# EAGLE design ShieldEsquematico (EAGLE 9.1.3)
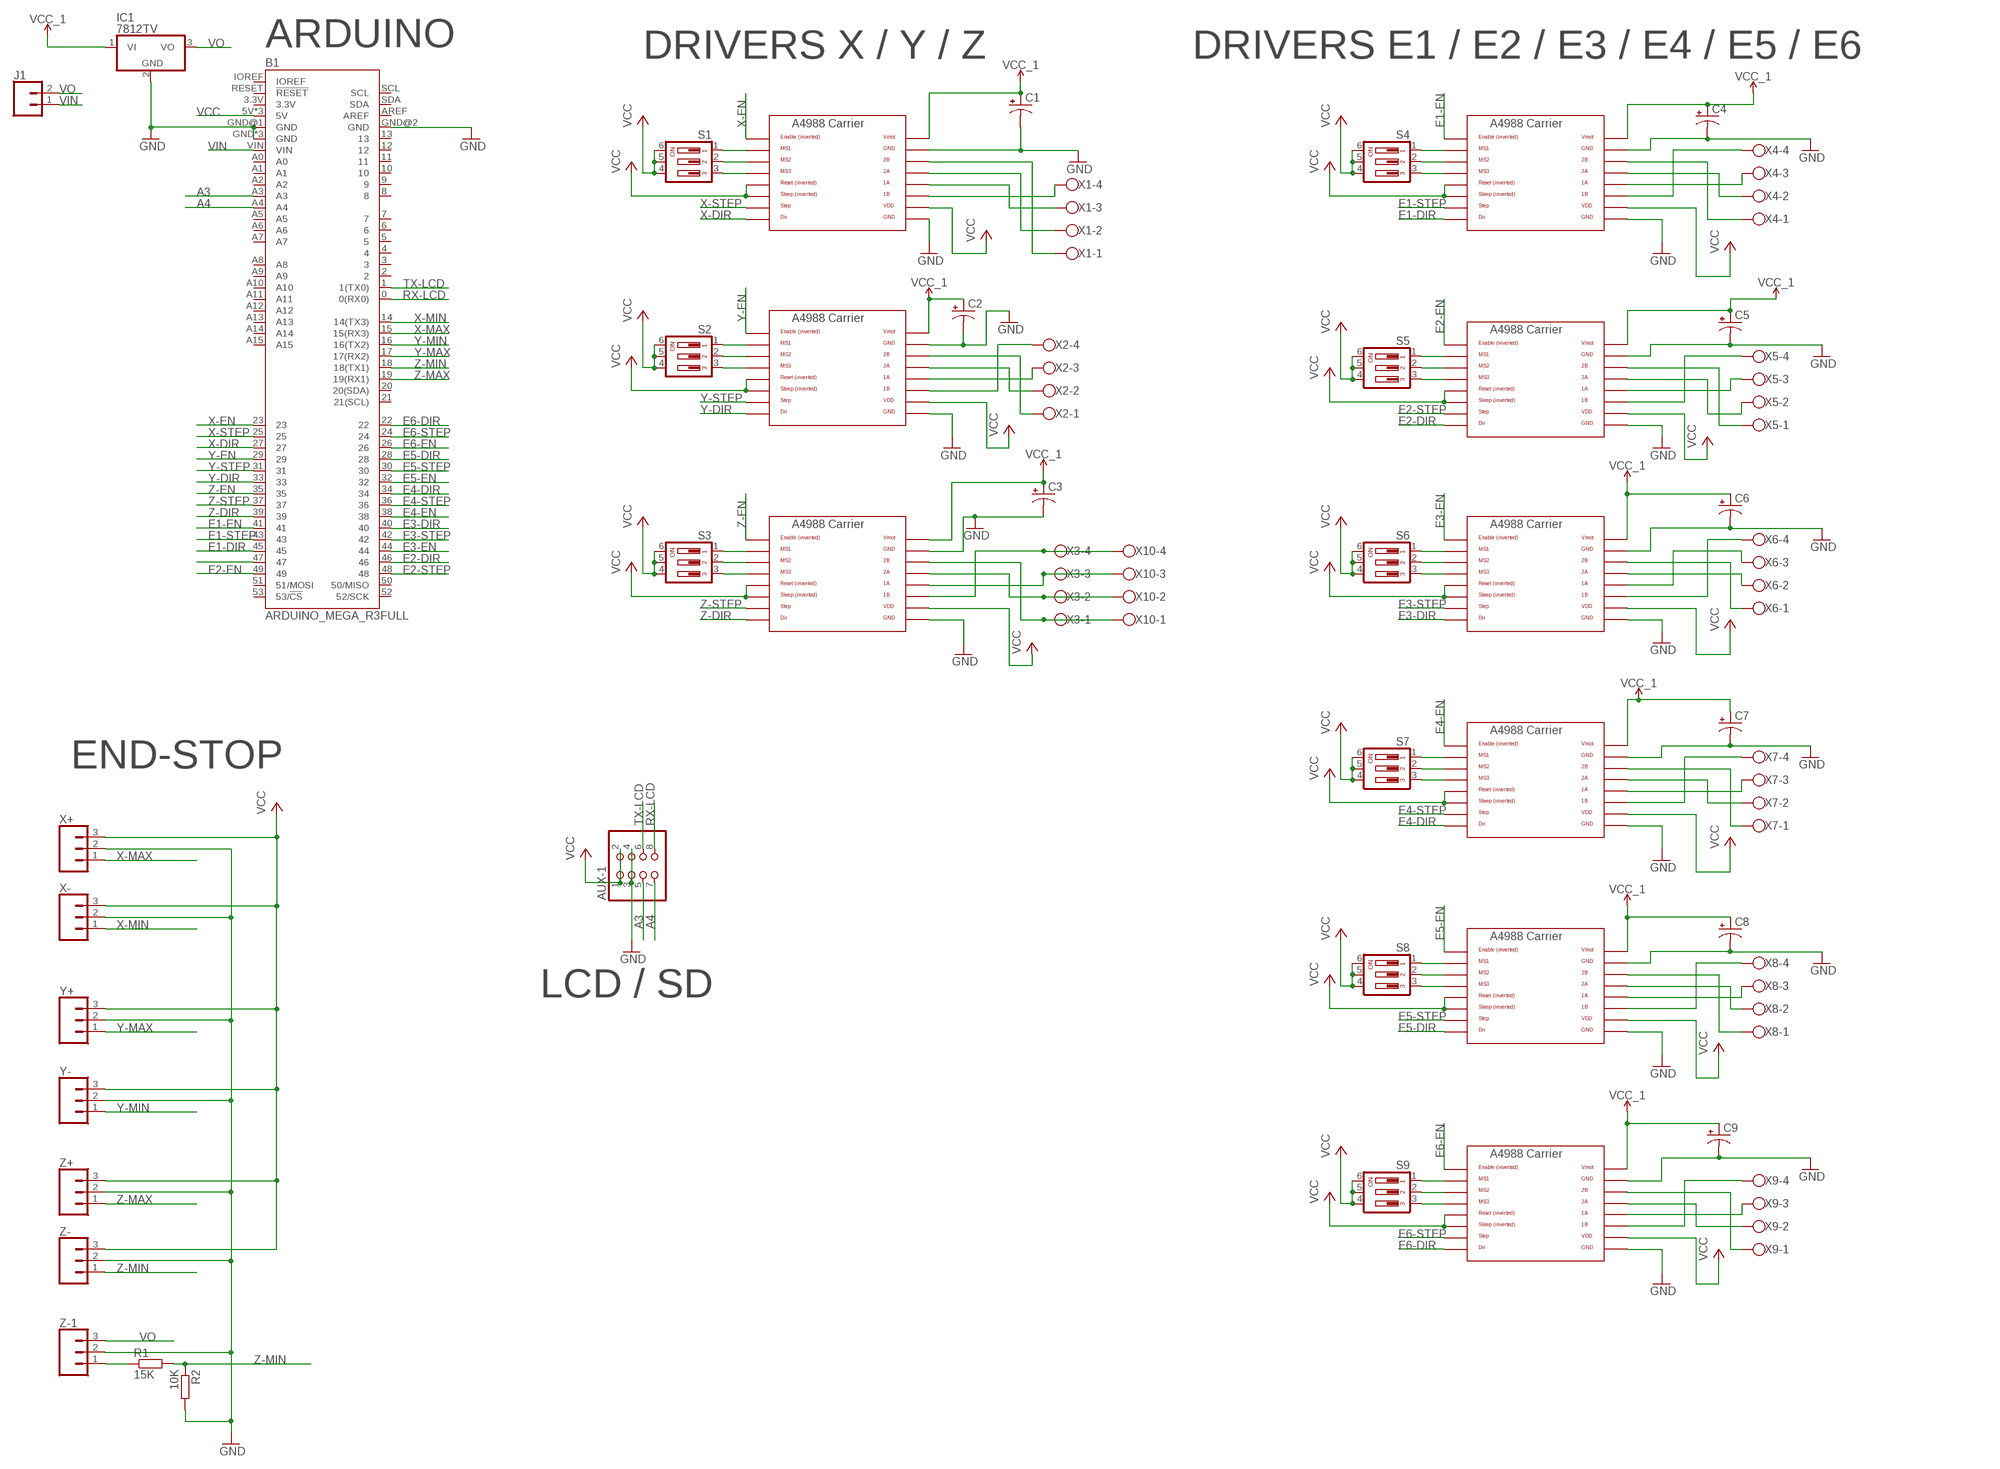
[diagram p0: schematic, sheet 1]

## Parts
AUX-1  PINHD-2X4  [2X04]
B1  ARDUINO_MEGA_R3FULL  [ARDUINO_MEGA_NO_SILK]
C1  CPOL-USE5-8.5  [E5-8,5]
C2  CPOL-USE5-8.5  [E5-8,5]
C3  CPOL-USE5-8.5  [E5-8,5]
C4  CPOL-USE5-8.5  [E5-8,5]
C5  CPOL-USE5-8.5  [E5-8,5]
C6  CPOL-USE5-8.5  [E5-8,5]
C7  CPOL-USE5-8.5  [E5-8,5]
C8  CPOL-USE5-8.5  [E5-8,5]
C9  CPOL-USE5-8.5  [E5-8,5]
IC1  7812TV  [TO220V]
J1  CONN_02  [1X02]
R1  15K  R-EU_0207/10  [0207/10]
R2  10K  R-EU_0207/10  [0207/10]
S1  DIP03YL  [DIP03YL]
S2  DIP03YL  [DIP03YL]
S3  DIP03YL  [DIP03YL]
S4  DIP03YL  [DIP03YL]
S5  DIP03YL  [DIP03YL]
S6  DIP03YL  [DIP03YL]
S7  DIP03YL  [DIP03YL]
S8  DIP03YL  [DIP03YL]
S9  DIP03YL  [DIP03YL]
U$1  A4988BREAKOUT  [A4988BREAKOUT]
U$2  A4988BREAKOUT  [A4988BREAKOUT]
U$3  A4988BREAKOUT  [A4988BREAKOUT]
U$4  A4988BREAKOUT  [A4988BREAKOUT]
U$5  A4988BREAKOUT  [A4988BREAKOUT]
U$6  A4988BREAKOUT  [A4988BREAKOUT]
U$7  A4988BREAKOUT  [A4988BREAKOUT]
U$8  A4988BREAKOUT  [A4988BREAKOUT]
U$9  A4988BREAKOUT  [A4988BREAKOUT]
X1  W237-4  [W237-4]
X2  W237-4  [W237-4]
X3  W237-4  [W237-4]
X4  W237-4  [W237-4]
X5  W237-4  [W237-4]
X6  W237-4  [W237-4]
X7  W237-4  [W237-4]
X8  W237-4  [W237-4]
X9  W237-4  [W237-4]
X10  W237-4  [W237-4]
X+  CONN_03SCREW_LOCK  [SCREWTERMINAL-3.5MM-3_LOCK.007S]
X-  CONN_03SCREW_LOCK  [SCREWTERMINAL-3.5MM-3_LOCK.007S]
Y+  CONN_03SCREW_LOCK  [SCREWTERMINAL-3.5MM-3_LOCK.007S]
Y-  CONN_03SCREW_LOCK  [SCREWTERMINAL-3.5MM-3_LOCK.007S]
Z+  CONN_03SCREW_LOCK  [SCREWTERMINAL-3.5MM-3_LOCK.007S]
Z-  CONN_03SCREW_LOCK  [SCREWTERMINAL-3.5MM-3_LOCK.007S]
Z-1  CONN_03SCREW_LOCK  [SCREWTERMINAL-3.5MM-3_LOCK.007S]

## Nets
A3: AUX-1.5 B1.A3
A4: AUX-1.7 B1.A4
E1-DIR: B1.45 U$4.DIR
E1-EN: B1.41 U$4.EN
E1-STEP: B1.43 U$4.STEP
E2-DIR: B1.46 U$5.DIR
E2-EN: B1.49 U$5.EN
E2-STEP: B1.48 U$5.STEP
E3-DIR: B1.40 U$6.DIR
E3-EN: B1.44 U$6.EN
E3-STEP: B1.42 U$6.STEP
E4-DIR: B1.34 U$7.DIR
E4-EN: B1.38 U$7.EN
E4-STEP: B1.36 U$7.STEP
E5-DIR: B1.28 U$8.DIR
E5-EN: B1.32 U$8.EN
E5-STEP: B1.30 U$8.STEP
E6-DIR: B1.22 U$9.DIR
E6-EN: B1.26 U$9.EN
E6-STEP: B1.24 U$9.STEP
GND: AUX-1.3 AUX-1.4 B1.GND B1.GND@1(GND) B1.GND@2(GND) B1.GND@3(GND) B1.GND@4(GND) C1.- C2.- C3.- C4.- C5.- C6.- C7.- C8.- C9.- IC1.2(GND) R2.2 U$1.GND U$1.GND@0(GND) U$2.GND U$2.GND@0(GND) U$3.GND U$3.GND@0(GND) U$4.GND U$4.GND@0(GND) U$5.GND U$5.GND@0(GND) U$6.GND U$6.GND@0(GND) U$7.GND U$7.GND@0(GND) U$8.GND U$8.GND@0(GND) U$9.GND U$9.GND@0(GND) X+.2 X-.2 Y+.2 Y-.2 Z+.2 Z-1.2 Z-.2
N$1: S1.1 U$1.MS1
N$2: S1.2 U$1.MS2
N$3: S1.3 U$1.MS3
N$4: U$1.1B X1.4
N$5: U$1.1A X1.3
N$6: U$1.2A X1.2
N$7: U$1.2B X1.1
N$8: S2.1 U$2.MS1
N$10: S2.2 U$2.MS2
N$11: S2.3 U$2.MS3
N$12: U$2.1B X2.4
N$13: U$3.2B X3.1 X10.1
N$14: U$2.2A X2.2
N$15: U$2.2B X2.1
N$16: S3.1 U$3.MS1
N$17: S3.2 U$3.MS2
N$18: S3.3 U$3.MS3
N$19: U$3.2A X3.2 X10.2
N$20: U$3.1A X3.3 X10.3
N$21: U$3.1B X3.4 X10.4
N$22: U$4.2B X4.1
N$23: S4.1 U$4.MS1
N$24: S4.2 U$4.MS2
N$25: S4.3 U$4.MS3
N$26: U$4.2A X4.2
N$27: U$4.1A X4.3
N$28: U$4.1B X4.4
N$29: U$6.1A X6.3
N$30: S5.1 U$5.MS1
N$31: S5.2 U$5.MS2
N$32: S5.3 U$5.MS3
N$33: U$5.2B X5.1
N$34: U$5.2A X5.2
N$35: U$5.1A X5.3
N$36: U$5.1B X5.4
N$37: S6.1 U$6.MS1
N$38: S6.2 U$6.MS2
N$39: S6.3 U$6.MS3
N$40: U$6.1B X6.4
N$41: U$7.2A X7.2
N$42: U$6.2A X6.2
N$43: U$6.2B X6.1
N$44: S7.1 U$7.MS1
N$45: S7.2 U$7.MS2
N$46: S7.3 U$7.MS3
N$47: U$7.1A X7.3
N$48: U$7.1B X7.4
N$49: U$9.2B X9.1
N$50: U$7.2B X7.1
N$51: S8.1 U$8.MS1
N$52: S8.2 U$8.MS2
N$53: S8.3 U$8.MS3
N$54: U$8.2B X8.1
N$55: U$8.2A X8.2
N$56: U$8.1A X8.3
N$57: U$8.1B X8.4
N$58: S9.1 U$9.MS1
N$59: S9.2 U$9.MS2
N$60: S9.3 U$9.MS3
N$61: U$9.2A X9.2
N$62: U$9.1A X9.3
N$63: U$9.1B X9.4
N$64: R1.1 Z-1.1
N$65: U$2.1A X2.3
N$76: B1.47
RX-LCD: AUX-1.8 B1.0(0(RX0))
TX-LCD: AUX-1.6 B1.1(1(TX0))
VCC: AUX-1.1 AUX-1.2 B1.5V B1.5V@1(5V) B1.5V@2(5V) S1.4 S1.5 S1.6 S2.4 S2.5 S2.6 S3.4 S3.5 S3.6 S4.4 S4.5 S4.6 S5.4 S5.5 S5.6 S6.4 S6.5 S6.6 S7.4 S7.5 S7.6 S8.4 S8.5 S8.6 S9.4 S9.5 S9.6 U$1.RST U$1.SLP(SLEEP) U$1.VDD U$2.RST U$2.SLP(SLEEP) U$2.VDD U$3.RST U$3.SLP(SLEEP) U$3.VDD U$4.RST U$4.SLP(SLEEP) U$4.VDD U$5.RST U$5.SLP(SLEEP) U$5.VDD U$6.RST U$6.SLP(SLEEP) U$6.VDD U$7.RST U$7.SLP(SLEEP) U$7.VDD U$8.RST U$8.SLP(SLEEP) U$8.VDD U$9.RST U$9.SLP(SLEEP) U$9.VDD X+.3 X-.3 Y+.3 Y-.3 Z+.3 Z-.3
VCC_1: C1.+ C2.+ C3.+ C4.+ C5.+ C6.+ C7.+ C8.+ C9.+ IC1.1(VI) U$1.VMOT U$2.VMOT U$3.VMOT U$4.VMOT U$5.VMOT U$6.VMOT U$7.VMOT U$8.VMOT U$9.VMOT
VIN: B1.VIN J1.1
VO: IC1.3(VO) J1.2 Z-1.3
X-DIR: B1.27 U$1.DIR
X-EN: B1.23 U$1.EN
X-MAX: B1.15(15(RX3)) X+.1
X-MIN: B1.14(14(TX3)) X-.1
X-STEP: B1.25 U$1.STEP
Y-DIR: B1.33 U$2.DIR
Y-EN: B1.29 U$2.EN
Y-MAX: B1.17(17(RX2)) Y+.1
Y-MIN: B1.16(16(TX2)) Y-.1
Y-STEP: B1.31 U$2.STEP
Z-DIR: B1.39 U$3.DIR
Z-EN: B1.35 U$3.EN
Z-MAX: B1.19(19(RX1)) Z+.1
Z-MIN: B1.18(18(TX1)) R1.2 R2.1 Z-.1
Z-STEP: B1.37 U$3.STEP
Unconnected: B1.2 B1.3 B1.3.3V B1.4 B1.5 B1.6 B1.7 B1.8 B1.9 B1.10 B1.11 B1.12 B1.13 B1.20(20(SDA)) B1.21(21(SCL)) B1.50(50/MISO) B1.51(51/MOSI) B1.52(52/SCK) B1.53(53/!CS) B1.A0 B1.A1 B1.A2 B1.A5 B1.A6 B1.A7 B1.A8 B1.A9 B1.A10 B1.A11 B1.A12 B1.A13 B1.A14 B1.A15 B1.AREF B1.IOREF B1.RESET(!RESET) B1.SCL B1.SDA

## Notes on the sheet
- ARDUINO | DRIVERS X / Y / Z | DRIVERS E1 / E2 / E3 / E4 / E5 / E6
- END-STOP
- LCD / SD

## Library data of the parts
AUX-1 = pinhead:PINHD-2X4: PIN HEADER
B1 = SparkFun-Boards:ARDUINO_MEGA_R3: Arduino Mega R3 ATmega2560 R3 compatible footprint. SparkFun Products: Arduino Mega 2560 R3 <https://www.sparkfun.com/products/11061>
C1-C9 = resistor:CPOL-US: POLARIZED CAPACITOR, American symbol
IC1 = linear:78*: Positive VOLTAGE REGULATOR Source: http://cache.national.com/ds/LM/LM78L05.pdf http://www.fairchildsemi.com/ds/LM/LM7805.pdf
J1 = SparkFun-Connectors:CONN_02: Multi connection point. Often used as Generic Header-pin footprint for 0.1 inch spaced/style header connections On any of the 0.1 inch spaced packages, you can populate with these: Break Away Headers - Straight <https://www.sparkfun.com/products/116> (PRT-00116) Break Away Male Headers - Right Angle <https://www.sparkfun.com/products/553> (PRT-00553) Female Headers <https://www.sparkfun.com/products/115> (PRT-00115) Break Away Headers - Machine Pin <https://www.sparkfun.com/products/117> (PRT-00117) Break Away Female Headers - Swiss Machine Pin <https://www.sparkfun.com/products/743> (PRT-00743) For SCREWTERMINALS and SPRING TERMINALS visit here: Screw Terimnals on SparkFun.com <https://www.sparkfun.com/search/results?term=Screw+Terminals> (5mm/3.5mm/2.54mm spacing) This device is also useful as a general connection point to wire up your design to another part of your project. Our various solder wires solder well into these plated through hole pads. Hook-Up Wire - Assortment (Stranded, 22 AWG) <https://www.sparkfun.com/products/11375> (PRT-11375) Hook-Up Wire - Assortment (Solid Core, 22 AWG) <https://www.sparkfun.com/products/11367> (PRT-11367) View the entire wire category on our website here <https://www.sparkfun.com/categories/141> Special notes: Molex polarized connector foot print use with: PRT-08233 with associated crimp pins and housings. 2.54_SCREWTERM for use with PRT-10571. 3.5mm Screw Terminal footprints for PRT-08084 5mm Screw Terminal footprints for use with PRT-08432
R1 R2 = rcl:R-EU_: RESISTOR, European symbol; SPICEPREFIX: R
S1-S9 = switch-dil:DIP03YL: DIL/CODE SWITCH; OC_FARNELL: unknown; OC_NEWARK: unknown
U$1-U$9 = RepRapjr:A4988BREAKOUT
X1-X10 = con-wago-500:W237-4: WAGO SCREW CLAMP; OC_FARNELL: unknown; OC_NEWARK: unknown
X+ X- Y+ Y- Z+ Z- Z-1 = SparkFun-Connectors:CONN_03: Multi connection point. Often used as Generic Header-pin footprint for 0.1 inch spaced/style header connections On any of the 0.1 inch spaced packages, you can populate with these: Break Away Headers - Straight <https://www.sparkfun.com/products/116> (PRT-00116) Break Away Male Headers - Right Angle <https://www.sparkfun.com/products/553> (PRT-00553) Female Headers <https://www.sparkfun.com/products/115> (PRT-00115) Break Away Headers - Machine Pin <https://www.sparkfun.com/products/117> (PRT-00117) Break Away Female Headers - Swiss Machine Pin <https://www.sparkfun.com/products/743> (PRT-00743) Stackable Header - 3 Pin (Female, 0.1") <https://www.sparkfun.com/products/13875> (PRT-13875) For SCREWTERMINALS and SPRING TERMINALS visit here: Screw Terimnals on SparkFun.com <https://www.sparkfun.com/search/results?term=Screw+Terminals> (5mm/3.5mm/2.54mm spacing) This device is also useful as a general connection point to wire up your design to another part of your project. Our various solder wires solder well into these plated through hole pads. Hook-Up Wire - Assortment (Stranded, 22 AWG) <https://www.sparkfun.com/products/11375> (PRT-11375) Hook-Up Wire - Assortment (Solid Core, 22 AWG) <https://www.sparkfun.com/products/11367> (PRT-11367) View the entire wire category on our website here <https://www.sparkfun.com/categories/141> Special notes: Molex polarized connector foot print use with SKU : PRT-08232 with associated crimp pins and housings.; PROD_ID: CONN-08288; SF_ID: PRT-08235

## Board
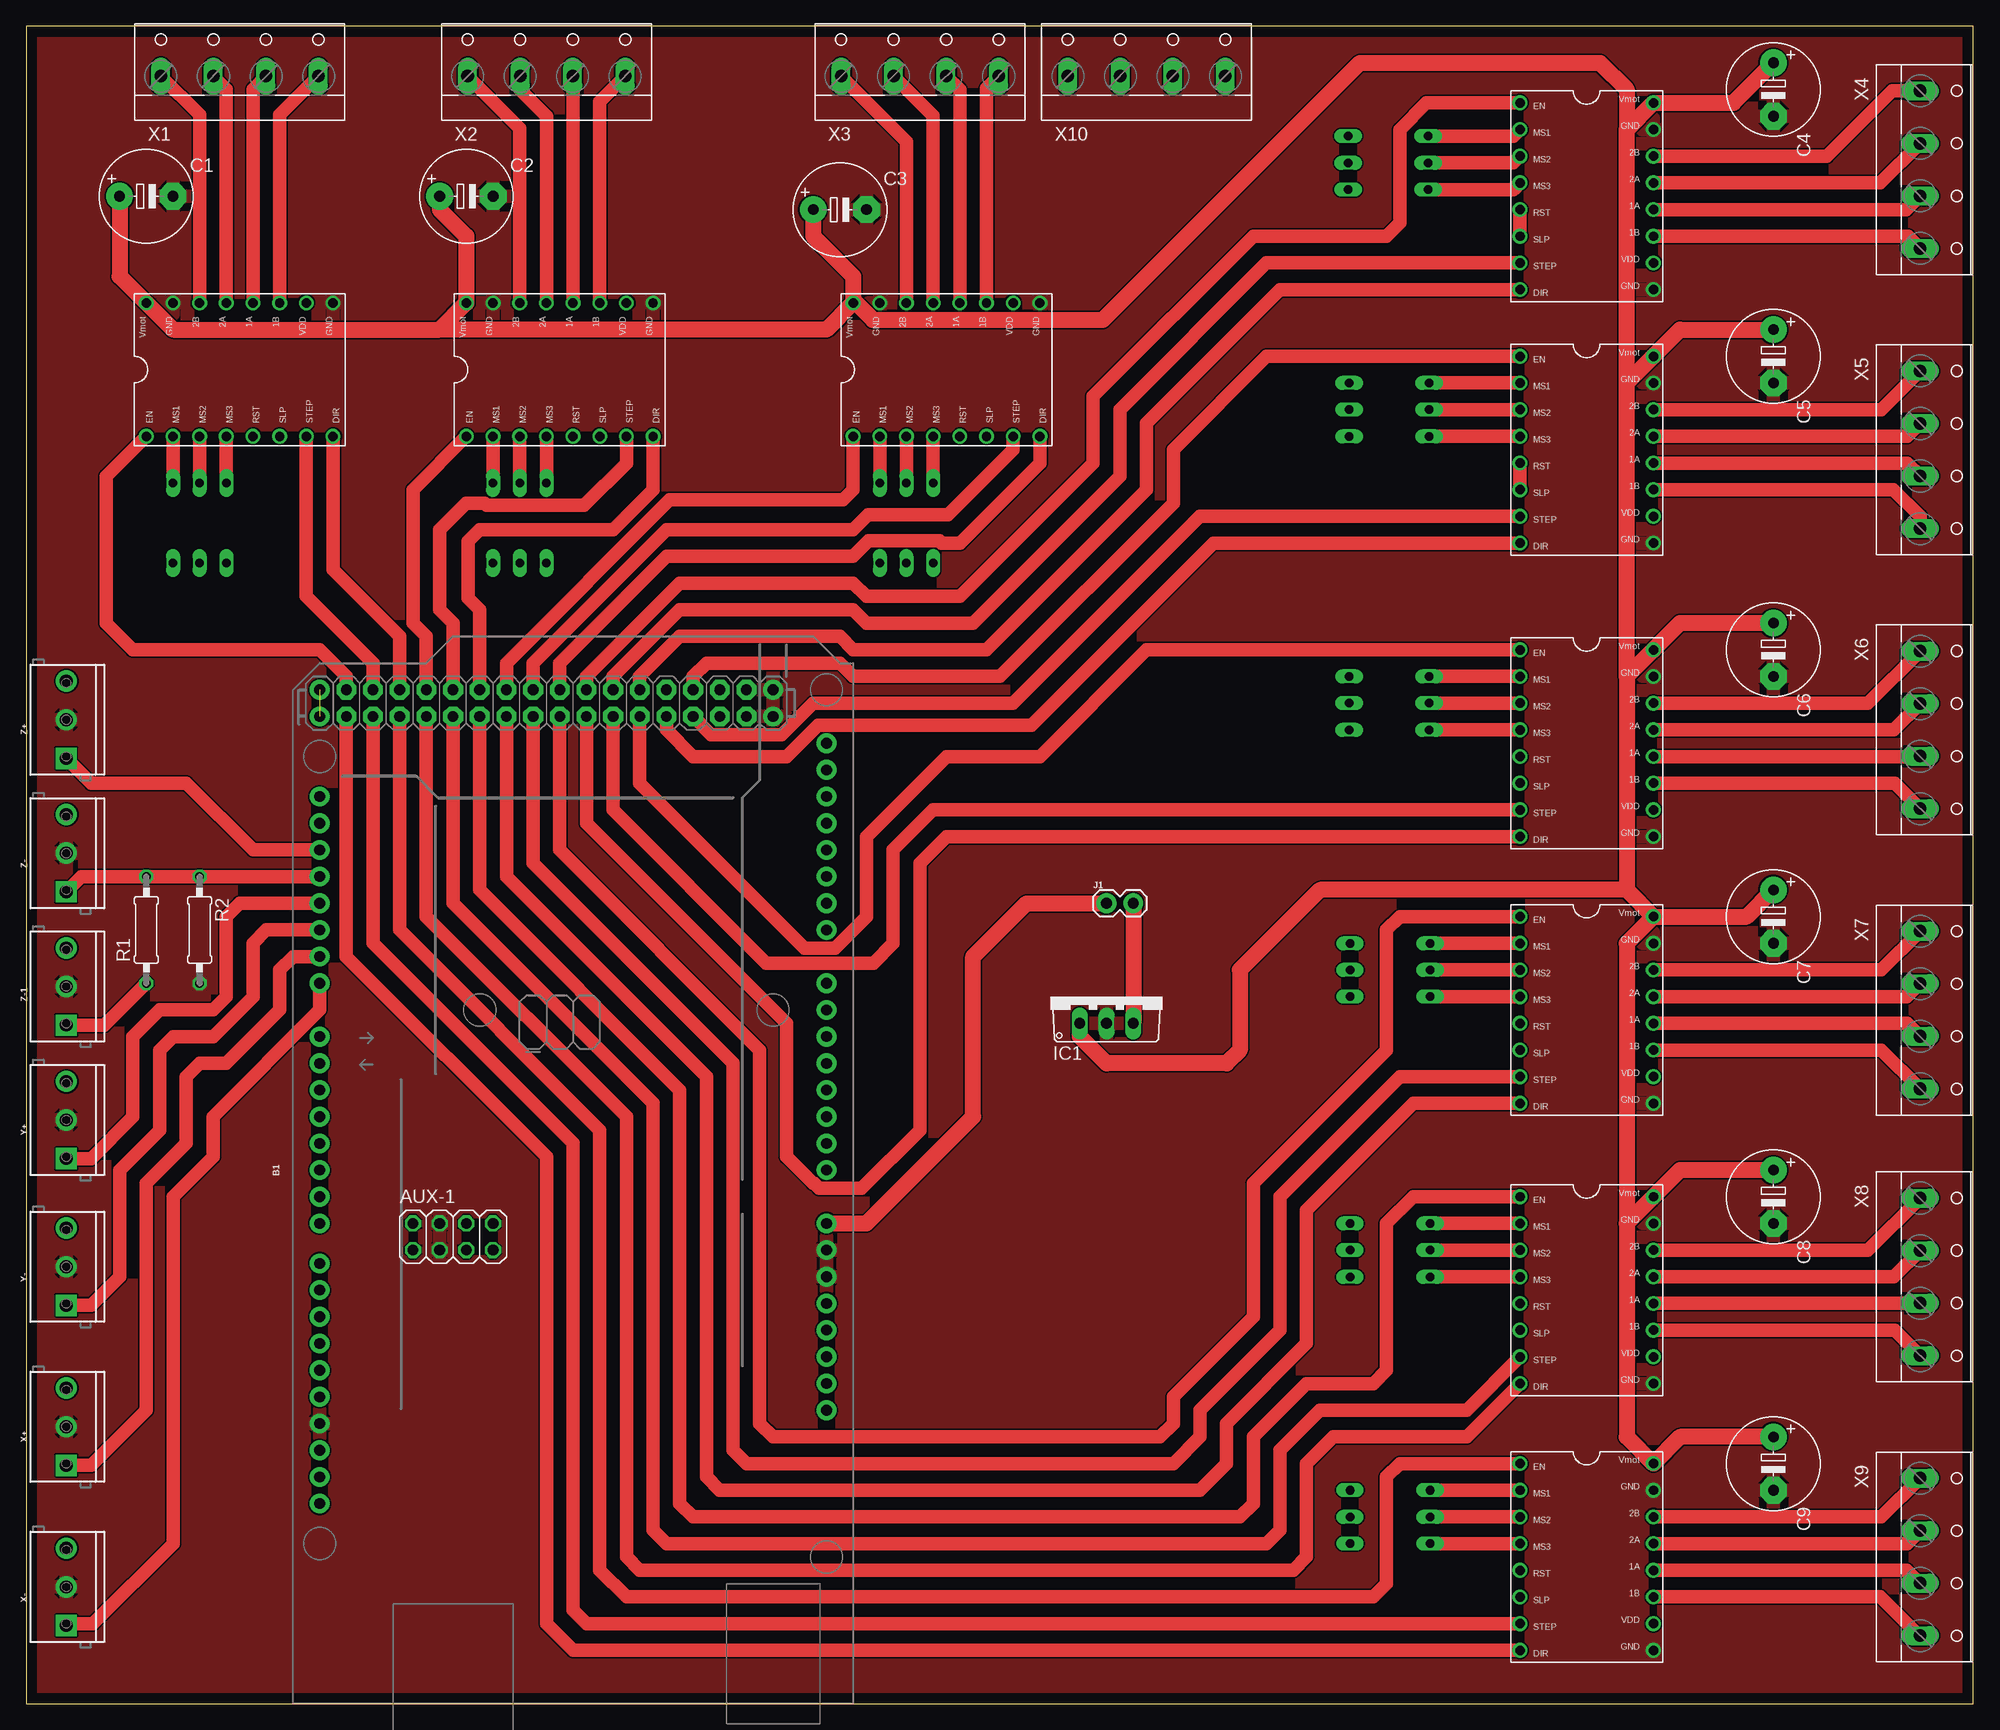
[diagram p1: board, top side]
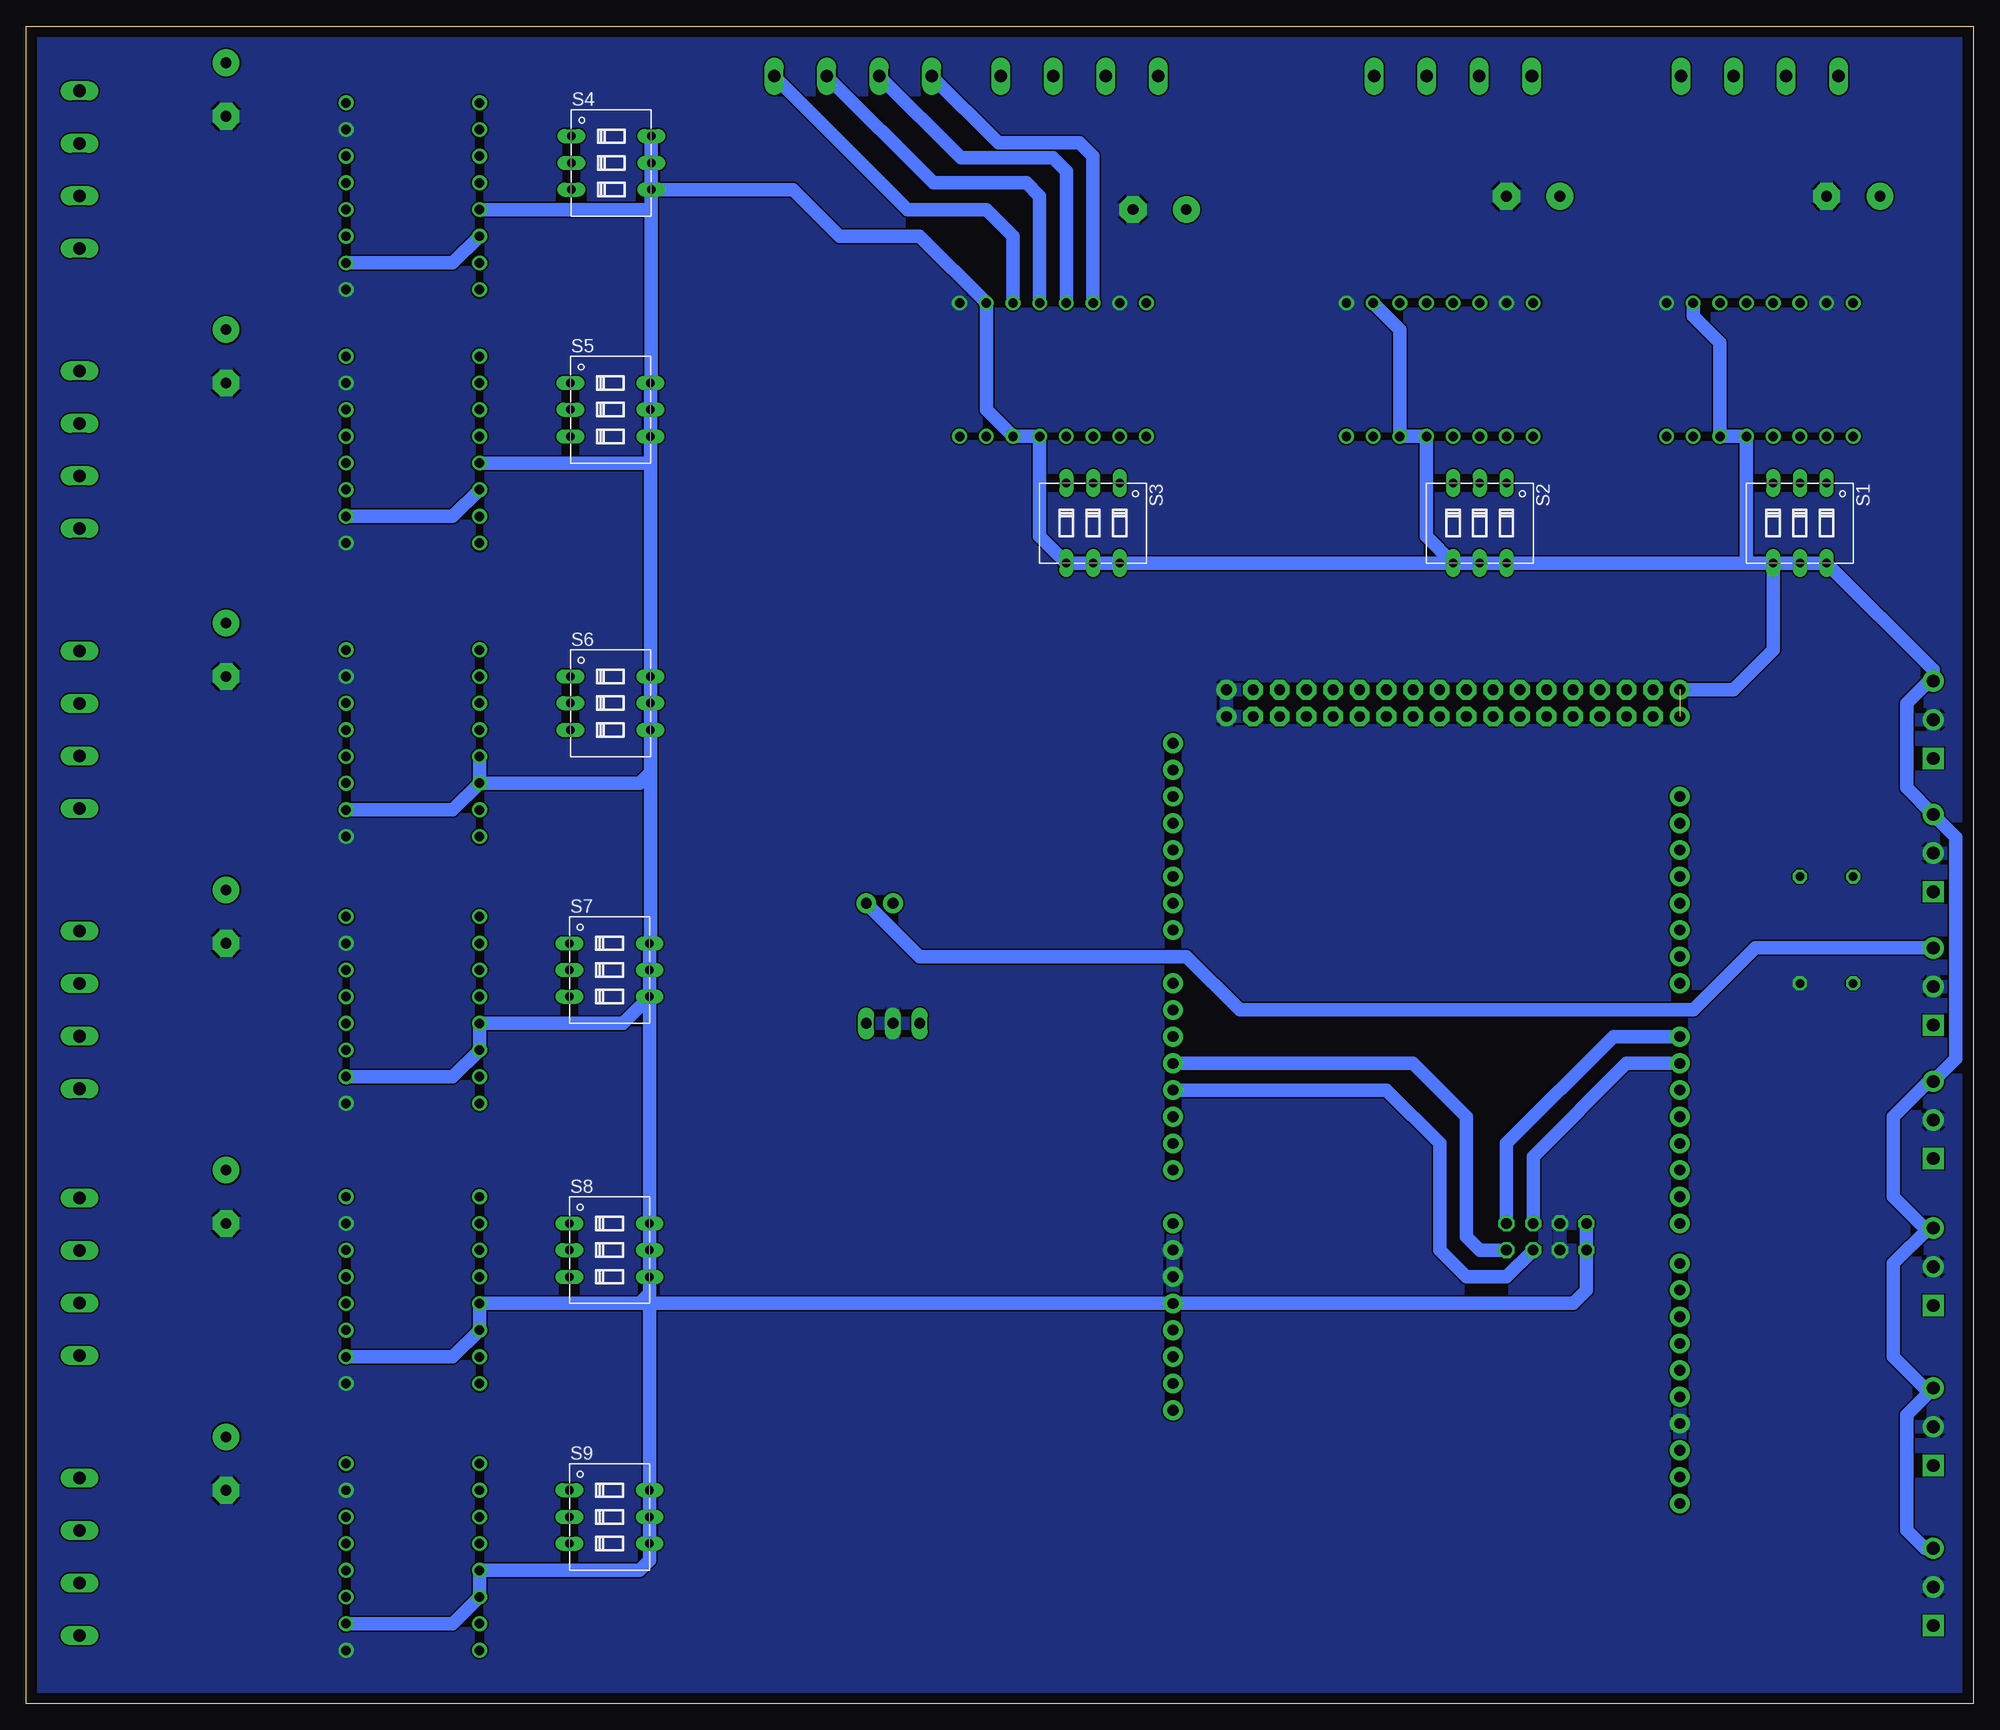
[diagram p2: board, bottom side, seen from below]

Size 185.4 x 159.69 mm. Coordinates in mm from the lower left corner, seen from the top.
Outline: 0,0 185.4,0 185.4,159.69 0,159.69 0,0
Copper layers (1*16): Top 0.035mm / dielectric 1.5mm / Bottom 0.035mm
Design rules "default": minimum track width 6mil, minimum drill 0.35mm, track to track 6mil, track to pad 6mil, pad to pad 6mil, via to via 6mil, smd to smd 6mil, copper to edge 40mil, drill to drill 6mil, minimum pad ring 10mil, minimum via ring 8mil, stop-mask expansion 4mil, vias tented up to drill 0mil, thermal gap 10mil

### Footprints (pad centres in the part's own frame; a part is rotated, then mirrored left to right if it is on the bottom)
2X04 = drill 1.016 octagon: 1 -3.81,-1.27; 2 -3.81,1.27; 3 -1.27,-1.27; 4 -1.27,1.27; 5 1.27,-1.27; 6 1.27,1.27; 7 3.81,-1.27; 8 3.81,1.27
ARDUINO_MEGA_NO_SILK = drill 1.016 pad 1.88: 0 13.97,24.13; 1 11.43,24.13; 2 8.89,24.13; 3 6.35,24.13; 3.3V -13.97,-24.13; 4 3.81,24.13; 5 1.27,24.13; 5V -11.43,-24.13; 5V@1 44.45,24.13; 5V@2 46.99,24.13; 6 -1.27,24.13; 7 -3.81,24.13; 8 -7.62,24.13; 9 -10.16,24.13; 10 -12.7,24.13; 11 -15.24,24.13; 12 -17.78,24.13; 13 -20.32,24.13; 14 19.05,24.13; 15 21.59,24.13; 16 24.13,24.13; 17 26.67,24.13; 18 29.21,24.13; 19 31.75,24.13; 20 34.29,24.13; 21 36.83,24.13; A0 1.27,-24.13; A1 3.81,-24.13; A2 6.35,-24.13; A3 8.89,-24.13; A4 11.43,-24.13; A5 13.97,-24.13; A6 16.51,-24.13; A7 19.05,-24.13; A8 24.13,-24.13; A9 26.67,-24.13; A10 29.21,-24.13; A11 31.75,-24.13; A12 34.29,-24.13; A13 36.83,-24.13; A14 39.37,-24.13; A15 41.91,-24.13; AREF -25.4,24.13; GND -8.89,-24.13; GND@1 -6.35,-24.13; GND@2 44.45,-19.05; GND@3 46.99,-19.05; GND@4 -22.86,24.13; IOREF -19.05,-24.13; NC -21.59,-24.13; RESET -16.51,-24.13; SCL -30.48,24.13; SDA -27.94,24.13; VIN -3.81,-24.13 | drill 1.016 pad 1.88 octagon: 22 44.45,21.59; 23 46.99,21.59; 24 44.45,19.05; 25 46.99,19.05; 26 44.45,16.51; 27 46.99,16.51; 28 44.45,13.97; 29 46.99,13.97; 30 44.45,11.43; 31 46.99,11.43; 32 44.45,8.89; 33 46.99,8.89; 34 44.45,6.35; 35 46.99,6.35; 36 44.45,3.81; 37 46.99,3.81; 38 44.45,1.27; 39 46.99,1.27; 40 44.45,-1.27; 41 46.99,-1.27; 42 44.45,-3.81; 43 46.99,-3.81; 44 44.45,-6.35; 45 46.99,-6.35; 46 44.45,-8.89; 47 46.99,-8.89; 48 44.45,-11.43; 49 46.99,-11.43; 50 44.45,-13.97; 51 46.99,-13.97; 52 44.45,-16.51; 53 46.99,-16.51
E5-8,5 = drill 1.016 pad 2.54: + -2.54,0 | drill 1.016 pad 2.54 octagon: - 2.54,0
TO220V = drill 1.016 long: 1 -2.54,-2.54; 2 0,-2.54; 3 2.54,-2.54
1X02 = drill 1.016 pad 1.88: 1 0,0; 2 2.54,0
0207/10 = drill 0.813 octagon: 1 -5.08,0; 2 5.08,0
DIP03YL = drill 0.813 long: 1 -2.54,-3.81; 2 0,-3.81; 3 2.54,-3.81; 4 2.54,3.81; 5 0,3.81; 6 -2.54,3.81
A4988BREAKOUT = drill 0.9: 1A 8.89,1.27; 1B 11.43,1.27; 2A 6.35,1.27; 2B 3.81,1.27; DIR 16.51,-11.43; EN -1.27,-11.43; GND 16.51,1.27; GND@0 1.27,1.27; MS1 1.27,-11.43; MS2 3.81,-11.43; MS3 6.35,-11.43; RST 8.89,-11.43; SLP 11.43,-11.43; STEP 13.97,-11.43; VDD 13.97,1.27; VMOT -1.27,1.27
W237-4 = drill 1.194 long: 1 -7.5,-1.27; 2 -2.5,-1.27; 3 2.5,-1.27; 4 7.5,-1.27
SCREWTERMINAL-3.5MM-3_LOCK.007S = drill 1.2 pad 2.032 square: 1 -0.178,0 | drill 1.2 pad 2.032: 2 3.5,0; 3 7.178,0

### Placement (x,y rotation side)
AUX-1  40.64,44.45 0 top
B1  52.07,49.53 90 top
C1  11.43,143.51 0 top
C2  41.91,143.51 0 top
C3  77.47,142.24 0 top
C4  166.37,153.67 270 top
C5  166.37,128.27 270 top
C6  166.37,100.33 270 top
C7  166.37,74.93 270 top
C8  166.37,48.26 270 top
C9  166.37,22.86 270 top
IC1  102.87,67.31 0 top
J1  102.87,76.2 0 top
R1  11.43,73.66 90 top
R2  16.51,73.66 270 top
S1  16.51,112.39 180 bottom
S2  46.99,112.39 180 bottom
S3  83.82,112.39 180 bottom
S4  129.7,146.69 270 bottom
S5  129.78,123.19 270 bottom
S6  129.78,95.25 270 bottom
S7  129.86,69.85 270 bottom
S8  129.86,43.18 270 bottom
S9  129.86,17.78 270 bottom
U$1  12.7,132.08 0 top
U$2  43.18,132.08 0 top
U$3  80.01,132.08 0 top
U$4  153.67,151.13 270 top
U$5  153.67,127 270 top
U$6  153.67,99.06 270 top
U$7  153.67,73.66 270 top
U$8  153.67,46.99 270 top
U$9  153.67,21.59 270 top
X1  20.32,156.21 0 top
X2  49.53,156.21 0 top
X3  85.09,156.21 0 top
X4  181.61,146.05 270 top
X5  181.61,119.38 270 top
X6  181.61,92.71 270 top
X7  181.61,66.04 270 top
X8  181.61,40.64 270 top
X9  181.61,13.97 270 top
X10  106.68,156.21 0 top
X+  3.81,22.86 90 top
X-  3.81,7.62 90 top
Y+  3.81,52.07 90 top
Y-  3.81,38.1 90 top
Z+  3.81,90.17 90 top
Z-  3.81,77.47 90 top
Z-1  3.81,64.77 90 top

### Tracks (layer width: path | path; a pad name or v marks a point on that pad's centre or on a via)
A3
  Bottom 1.27: B1.A3 55.88,58.42 50.8,53.34 50.8,43.18 48.26,40.64 44.45,40.64 AUX-1.5
A4
  Bottom 1.27: AUX-1.7 46.99,43.18 48.26,44.45 48.26,55.88 53.34,60.96 B1.A4
E1-DIR
  Top 1.27: U$4.DIR 119.38,134.62 106.68,121.92 106.68,115.57 91.44,100.33 78.74,100.33 77.47,101.6 62.23,101.6 58.42,97.79 B1.45
E1-EN
  Top 1.27: B1.41 53.34,97.79 62.23,106.68 78.74,106.68 80.01,105.41 88.9,105.41 101.6,118.11 101.6,124.46 116.84,139.7 129.54,139.7 130.81,140.97 130.81,149.86 133.35,152.4 U$4.EN
E1-STEP
  Top 1.27: U$4.STEP 118.11,137.16 104.14,123.19 104.14,116.84 90.17,102.87 80.01,102.87 78.74,104.14 62.23,104.14 55.88,97.79 B1.43
E2-DIR
  Top 1.27: B1.46 60.96,92.71 63.5,90.17 72.39,90.17 75.39,93.17 95.71,93.17 113.03,110.49 U$5.DIR
E2-EN
  Top 1.27: B1.49 63.5,97.79 64.77,99.06 77.47,99.06 78.74,97.79 92.71,97.79 109.22,114.3 109.22,119.38 118.11,128.27 U$5.EN
E2-STEP
  Top 1.27: B1.48 65.23,92.25 71.93,92.25 74.93,95.25 93.98,95.25 111.76,113.03 U$5.STEP
E3-DIR
  Top 1.27: U$6.DIR 87.63,82.55 85.09,80.01 85.09,54.61 79.55,49.07 75.48,49.07 75.03,49.53 74.93,49.53 72.39,52.07 72.39,64.77 53.34,83.82 B1.40
E3-EN
  Top 1.27: U$6.EN 106.68,100.33 96.52,90.17 87.63,90.17 80.01,82.55 80.01,74.93 77.01,71.93 74.12,71.93 58.42,87.63 B1.44
E3-STEP
  Top 1.27: U$6.STEP 86.36,85.09 82.55,81.28 82.55,72.39 80.67,70.51 70.46,70.51 55.88,85.09 B1.42
E4-DIR
  Top 1.27: B1.34 45.72,78.74 64.77,59.69 64.77,21.59 66.04,20.32 111.76,20.32 114.3,22.86 114.3,26.67 121.92,34.29 121.92,46.99 132.08,57.15 U$7.DIR
E4-EN
  Top 1.27: B1.38 50.8,81.28 69.85,62.23 69.85,26.67 71.12,25.4 107.95,25.4 109.22,26.67 109.22,29.21 116.84,36.83 116.84,49.53 129.54,62.23 129.54,73.66 130.81,74.93 U$7.EN
E4-STEP
  Top 1.27: B1.36 48.26,80.01 67.31,60.96 67.31,24.13 68.58,22.86 109.22,22.86 111.76,25.4 111.76,27.94 119.38,35.56 119.38,48.26 130.81,59.69 U$7.STEP
E5-DIR
  Top 1.27: B1.28 38.1,74.93 57.15,55.88 57.15,13.97 58.42,12.7 120.65,12.7 121.92,13.97 121.92,22.86 124.46,25.4 137.16,25.4 U$8.DIR
E5-EN
  Top 1.27: B1.32 43.18,77.47 62.23,58.42 62.23,19.05 63.5,17.78 115.57,17.78 116.84,19.05 116.84,25.4 121.92,30.48 128.27,30.48 129.54,31.75 129.54,45.72 132.08,48.26 U$8.EN
E5-STEP
  Top 1.27: B1.30 40.64,76.2 59.69,57.15 59.69,16.51 60.96,15.24 118.11,15.24 119.38,16.51 119.38,24.13 123.19,27.94 137.16,27.94 U$8.STEP
E6-DIR
  Top 1.27: B1.22 30.48,71.12 49.53,52.07 49.53,7.62 52.07,5.08 U$9.DIR
E6-EN
  Top 1.27: B1.26 35.56,73.66 54.61,54.61 54.61,12.7 57.15,10.16 128.27,10.16 129.54,11.43 129.54,21.59 130.81,22.86 U$9.EN
E6-STEP
  Top 1.27: B1.24 33.02,72.39 52.07,53.34 52.07,8.89 53.34,7.62 U$9.STEP
GND
  pour Bottom: 0,160.02 185.42,160.02 185.42,0 0,0
  pour Top: 0,160.02 184.15,160.02 185.42,158.75 185.42,0 0,0
N$1
  Top 1.27: U$1.MS1 S1.1
N$2
  Top 1.27: S1.2 U$1.MS2
N$3
  Top 1.27: U$1.MS3 S1.3
N$4
  Top 1.27: X1.4 24.13,151.25 U$1.1B
N$5
  Top 1.27: X1.3 21.59,153.71 U$1.1A
N$6
  Top 1.27: X1.2 19.05,153.71 U$1.2A
N$7
  Top 1.27: X1.1 16.51,151.25 U$1.2B
N$8
  Top 1.27: U$2.MS1 S2.1
N$10
  Top 1.27: U$2.MS2 S2.2
N$11
  Top 1.27: U$2.MS3 S2.3
N$12
  Top 1.27: X2.4 54.61,152.52 U$2.1B
N$13
  Top 1.27: X3.1 83.82,148.71 U$3.2B
  Bottom 1.27: X10.1 92.83,148.59 85.09,148.59 83.82,147.32 U$3.2B
N$14
  Top 1.27: X2.2 47.03,153.63 49.53,151.13 U$2.2A
N$15
  Top 1.27: X2.1 46.99,149.98 U$2.2B
N$16
  Top 1.27: S3.1 U$3.MS1
N$17
  Top 1.27: U$3.MS2 S3.2
N$18
  Top 1.27: U$3.MS3 S3.3
N$19
  Top 1.27: X3.2 86.36,151.17 U$3.2A
  Bottom 1.27: X10.2 96.41,147.17 87.63,147.17 86.36,145.9 U$3.2A
N$20
  Top 1.27: X3.3 88.9,153.63 U$3.1A
  Bottom 1.27: X10.3 99.02,144.78 90.17,144.78 88.9,143.51 U$3.1A
N$21
  Top 1.27: X3.4 91.44,153.79 U$3.1B
  Bottom 1.27: X10.4 101.48,142.24 93.98,142.24 91.44,139.7 U$3.1B
N$22
  Top 1.27: U$4.2B 171.45,147.32 177.68,153.55 X4.1
N$23
  Top 1.27: S4.1 141.6,149.23 U$4.MS1
N$24
  Top 1.27: S4.2 141.6,146.69 U$4.MS2
N$25
  Top 1.27: S4.3 141.6,144.15 U$4.MS3
N$26
  Top 1.27: U$4.2A 176.57,144.78 X4.2
N$27
  Top 1.27: U$4.1A 179.03,142.24 X4.3
N$28
  Top 1.27: U$4.1B 179.19,139.7 X4.4
N$29
  Top 1.27: U$6.1A 180.3,90.17 X6.3
N$30
  Top 1.27: S5.1 U$5.MS1
N$31
  Top 1.27: U$5.MS2 S5.2
N$32
  Top 1.27: S5.3 U$5.MS3
N$33
  Top 1.27: U$5.2B 176.65,123.19 X5.1
N$34
  Top 1.27: U$5.2A 179.11,120.65 X5.2
N$35
  Top 1.27: U$5.1A 179.11,118.11 X5.3
N$36
  Top 1.27: U$5.1B 177.8,115.57 180.34,113.03 X5.4 180.34,111.76
N$37
  Top 1.27: S6.1 U$6.MS1
N$38
  Top 1.27: S6.2 U$6.MS2
N$39
  Top 1.27: S6.3 U$6.MS3
N$40
  Top 1.27: U$6.1B 177.92,87.63 X6.4
N$41
  Top 1.27: U$7.2A 179.07,67.31 180.34,68.58 X7.2
N$42
  Top 1.27: U$6.2A 177.84,92.71 X6.2
N$43
  Top 1.27: U$6.2B 175.38,95.25 X6.1
N$44
  Top 1.27: S7.1 U$7.MS1
N$45
  Top 1.27: S7.2 U$7.MS2
N$46
  Top 1.27: S7.3 U$7.MS3
N$47
  Top 1.27: U$7.1A 179.11,64.77 X7.3
N$48
  Top 1.27: U$7.1B 176.65,62.23 X7.4
N$49
  Top 1.27: U$9.2B 176.65,17.78 X9.1
N$50
  Top 1.27: U$7.2B 176.65,69.85 X7.1
N$51
  Top 1.27: S8.1 U$8.MS1
N$52
  Top 1.27: S8.2 U$8.MS2
N$53
  Top 1.27: S8.3 U$8.MS3
N$54
  Top 1.27: U$8.2B 175.38,43.18 X8.1
N$55
  Top 1.27: U$8.2A 177.84,40.64 X8.2
N$56
  Top 1.27: U$8.1A 180.3,38.1 X8.3
N$57
  Top 1.27: U$8.1B 177.92,35.56 X8.4
N$58
  Top 1.27: S9.1 U$9.MS1
N$59
  Top 1.27: S9.2 U$9.MS2
N$60
  Top 1.27: S9.3 U$9.MS3
N$61
  Top 1.27: U$9.2A 179.11,15.24 X9.2
N$62
  Top 0.152: X9.3 180.34,11.48 180.31,11.46
  Top 1.27: U$9.1A 179.07,12.7 180.31,11.46 180.34,11.43
N$63
  Top 0.152: X9.4 180.34,6.45 180.29,6.4
  Top 1.27: U$9.1B 176.53,10.16 180.29,6.4 180.34,6.35
N$64
  Top 1.27: Z-1.1 7.44,64.59 R1.1
N$65
  Top 1.27: X2.3 52.07,154.9 U$2.1A
RX-LCD
  Bottom 1.27: B1.0 34.29,63.5 44.45,53.34 AUX-1.8
TX-LCD
  Bottom 1.27: B1.1 33.02,60.96 41.91,52.07 AUX-1.6
VCC  (1 unrouted)
  Top 1.27: U$4.RST U$4.SLP | U$5.RST U$5.SLP
  Bottom 1.27: S4.6 S4.5 S4.4 | 125.97,88.66 S6.4 S6.5 S6.6 125.97,118.11 | 125.97,88.66 127,87.63 U$6.SLP | U$6.SLP 144.78,85.09 U$6.VDD | U$5.SLP 144.78,113.03 U$5.VDD | 125.97,118.11 S5.4 S5.5 S5.6 125.89,125.81 125.89,142.24 | U$5.RST 125.97,118.11 | U$4.SLP 144.78,137.16 U$4.VDD | S4.4 125.89,142.24 | U$4.RST 125.89,142.24 | U$1.VDD 26.67,132.08 24.13,129.54 U$1.SLP U$1.RST 21.59,108.58 | S1.4 S1.5 S1.6 3.81,98.42 Z+.3 4.25,97.35 6.35,95.25 6.35,87.19 Z-.3 1.65,82.49 1.65,61.41 Y+.3 4.25,59.25 7.62,55.88 7.62,48.26 4.64,45.28 Y-.3 4.25,45.28 7.62,41.91 7.62,33.02 4.64,30.04 X+.3 6.35,27.5 6.35,16.51 4.64,14.8 X-.3 | S2.4 S2.5 S2.6 21.59,108.58 | S2.4 52.07,111.12 U$2.RST U$2.SLP 54.61,130.81 U$2.VDD | S1.4 21.59,108.58 | S1.4 19.05,100.33 22.86,96.52 B1.5V@2 | S2.4 S3.6 S3.5 S3.4 88.9,111.12 U$3.RST U$3.SLP 93.98,123.19 U$3.VDD 100.33,139.7 107.95,139.7 112.39,144.15 S4.4 | U$7.VDD 144.78,59.69 U$7.SLP U$7.RST 128.59,64.77 S7.4 | 125.97,88.66 125.97,72.47 S7.6 S7.5 S7.4 | U$6.RST U$6.SLP | S7.4 S8.6 S8.5 S8.4 126.05,39.05 | 126.05,39.05 127,38.1 | 127,38.1 U$8.RST U$8.SLP 144.78,33.02 U$8.VDD | 126.05,39.05 S9.6 S9.5 S9.4 126.05,13.65 127,12.7 U$9.RST U$9.SLP 144.78,7.62 U$9.VDD | 127,38.1 B1.5V 38.1,38.1 36.83,39.37 AUX-1.1 AUX-1.2
VCC_1
  Top 1.524: U$7.VMOT 152.4,77.47 | 152.4,77.47 123.19,77.47 115.57,69.85 115.57,62.23 114.3,60.96 102.87,60.96 100.33,63.5 IC1.1 | C9.+ 157.48,25.4 U$9.VMOT 152.4,25.4 152.4,45.72 | C8.+ 157.48,50.8 U$8.VMOT 152.4,45.72 | U$7.VMOT 152.4,72.39 152.4,45.72 | C6.+ 157.48,102.87 U$6.VMOT 152.4,97.79 | 152.4,97.79 152.4,77.47 | U$7.VMOT 163.83,74.93 C7.+ | 152.4,97.79 152.4,125.73 | 152.4,125.73 U$5.VMOT 157.48,130.81 C5.+ | 152.4,125.73 152.4,149.86 | C4.+ 162.56,152.4 U$4.VMOT 152.4,149.86 | C1.+ 8.89,135.89 U$1.VMOT 13.97,130.81 39.37,130.81 | 39.37,130.81 U$2.VMOT 41.91,139.7 39.37,142.24 C2.+ | C3.+ 74.93,139.7 78.74,135.89 U$3.VMOT | U$3.VMOT 76.2,130.81 39.37,130.81 | U$3.VMOT 78.99,133.35 80.61,131.73 102.52,131.73 127,156.21 149.86,156.21 152.4,153.67 152.4,149.86
VIN
  Top 1.524: B1.VIN 80.01,45.72 90.17,55.88 90.17,71.12 95.25,76.2 J1.1
VO
  Top 1.524: J1.2 IC1.3
  Bottom 1.27: Z-1.3 20.76,71.95 26.67,66.04 69.85,66.04 74.93,71.12 100.33,71.12 J1.2
X-DIR
  Top 1.27: U$1.DIR 29.21,107.95 35.56,101.6 B1.27
X-EN
  Top 1.27: U$1.EN 7.62,116.84 7.62,102.87 10.16,100.33 27.94,100.33 30.48,97.79 B1.23
X-MAX
  Top 1.27: X+.1 6.17,22.68 11.43,27.94 11.43,49.53 15.24,53.34 15.24,59.69 16.51,60.96 19.05,60.96 24.13,66.04 24.13,69.85 25.4,71.12 B1.15
X-MIN
  Top 1.27: B1.14 27.94,66.04 17.78,55.88 17.78,52.07 13.97,48.26 13.97,15.24 6.35,7.62 3.99,7.62 X-.1
X-STEP
  Top 1.27: U$1.STEP 26.67,105.41 33.02,99.06 B1.25
Y-DIR
  Top 1.27: U$2.DIR 59.69,115.57 55.88,111.76 43.18,111.76 42.06,110.64 42.06,105.26 43.18,104.14 B1.33
Y-EN
  Top 1.27: B1.29 38.1,101.6 36.83,102.87 36.83,115.57 U$2.EN
Y-MAX
  Top 1.27: Y+.1 6.17,51.89 10.16,55.88 10.16,63.5 12.7,66.04 17.78,66.04 19.05,67.31 19.05,74.93 20.32,76.2 B1.17
Y-MIN
  Top 1.27: Y-.1 6.17,37.92 8.89,40.64 8.89,50.8 12.7,54.61 12.7,62.23 13.97,63.5 17.78,63.5 21.59,67.31 21.59,72.39 22.86,73.66 B1.16
Y-STEP
  Top 1.27: U$2.STEP 57.15,118.11 53.14,114.1 43.85,114.1 43.65,114.3 41.91,114.3 39.37,111.76 39.37,104.14 40.64,102.87 B1.31
Z-DIR
  Top 1.27: B1.39 50.8,99.06 60.96,109.22 78.74,109.22 80.21,110.69 86.96,110.69 87.16,110.49 88.9,110.49 96.52,118.11 U$3.DIR
Z-EN
  Top 1.27: U$3.EN 78.74,115.57 77.78,114.6 61.27,114.6 45.72,99.06 B1.35
Z-MAX
  Top 1.27: Z+.1 6.17,87.63 15.24,87.63 21.59,81.28 B1.19
Z-MIN
  Top 1.27: Z-.1 5.26,78.74 R1.2 R2.1 B1.18
Z-STEP
  Top 1.27: B1.37 48.26,99.06 60.96,111.76 78.74,111.76 80.16,113.18 87.78,113.18 93.98,119.38 U$3.STEP